# EAGLE design Program Cable (EAGLE 9.7.0)
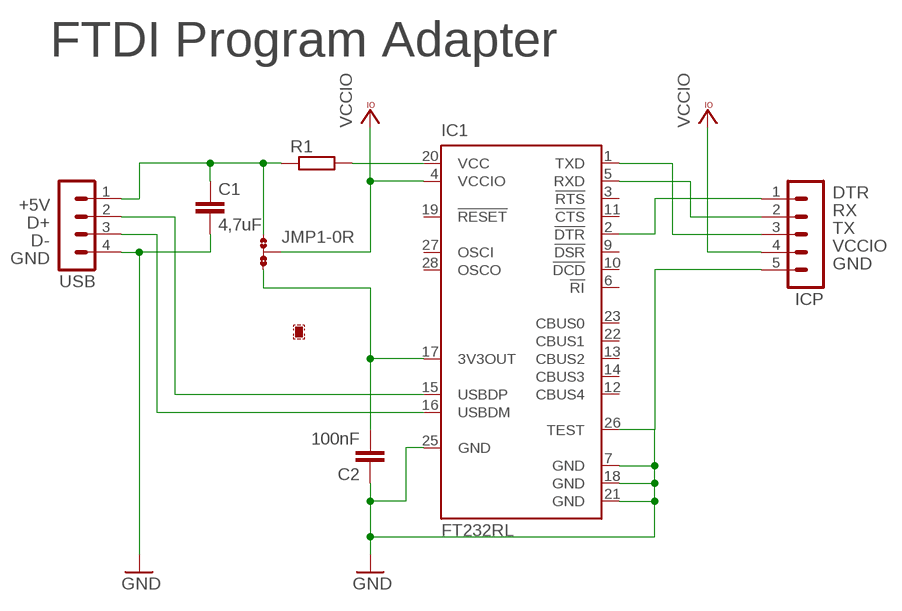
[diagram p0: schematic, sheet 1]

## Parts
C1  4,7uF  C-EUC1206  [C1206]
C2  100nF  C-EUC0402  [C0402]
IC1  FT232RL  [SSOP28]
ICP  MA05-1  [MA05-1]
JMP1  0R-JUMPA  [A0R-JMP]
R1  R-EU_R0805  [R0805]
USB  MA04-1  [MA04-1]

## Nets
3V3: C2.2 IC1.17(3V3OUT) JMP1.3
+5V: C1.1 JMP1.1 R1.1 USB.1
D+: IC1.15(USBDP) USB.2
D-: IC1.16(USBDM) USB.3
DTR: IC1.2(!DTR) ICP.1
GND: C1.2 C2.1 IC1.7(GND) IC1.18(GND) IC1.21(GND) IC1.25(GND) IC1.26(TEST) ICP.5 USB.4
N$1: IC1.20(VCC) R1.2
RX: IC1.5(RXD) ICP.2
TX: IC1.1(TXD) ICP.3
VCCIO: IC1.4(VCCIO) ICP.4 JMP1.2
Unconnected: IC1.3(!RTS) IC1.6(!RI) IC1.9(!DSR) IC1.10(!DCD) IC1.11(!CTS) IC1.12(CBUS4) IC1.13(CBUS2) IC1.14(CBUS3) IC1.19(!RESET) IC1.22(CBUS1) IC1.23(CBUS0) IC1.27(OSCI) IC1.28(OSCO)

## Notes on the sheet
- FTDI Program Adapter

## Library data of the parts
C1 C2 = rcl:C-EU: CAPACITOR, European symbol; SPICEPREFIX: C
IC1 = ftdichip:FT232R: Source: http://www.ftdichip.com/Documents/DataSheets/DS_FT232R_v104.pdf; MPN: FT232RL; OC_FARNELL: 1146032; OC_NEWARK: 91K9918
ICP = con-lstb:MA05-1: PIN HEADER; OC_FARNELL: unknown; OC_NEWARK: unknown
JMP1 = jump-0r-smd:0R-JUMP: SMD 0R 0805 Jumper
R1 = rcl:R-EU_: RESISTOR, European symbol; SPICEPREFIX: R
USB = con-lstb:MA04-1: PIN HEADER; OC_FARNELL: unknown; OC_NEWARK: unknown

## Board
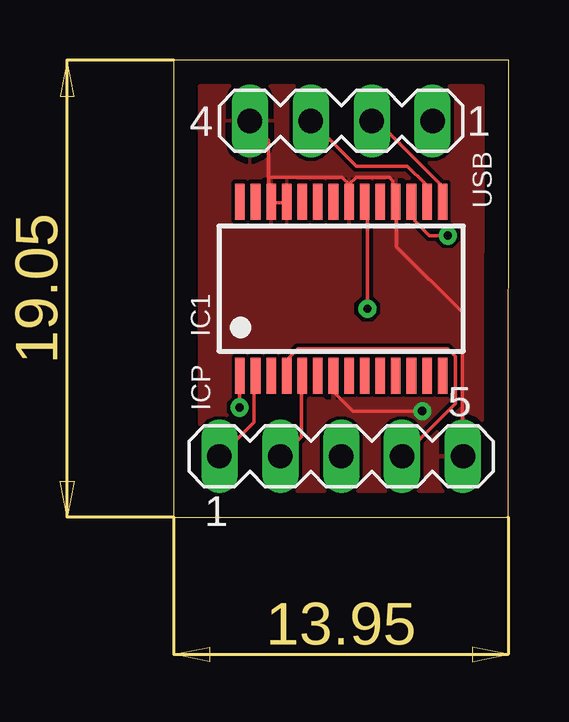
[diagram p1: board, top side]
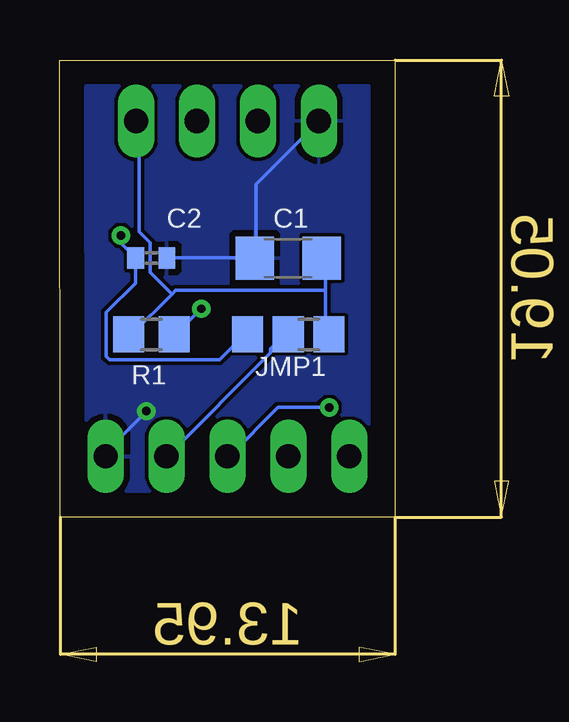
[diagram p2: board, bottom side, seen from below]

Size 13.97 x 19.05 mm. Coordinates in mm from the lower left corner, seen from the top.
Outline: 0,0 13.95,0 13.97,19.05 0,19.05 0,0
Copper layers (1*16): Top / Bottom
Stack-up Default Layer Stack: Top User Defined 0.035mm / Dielectric-1 User Defined 1.5mm / Bottom User Defined 0.035mm
Design rules "default": minimum track width 6mil, minimum drill 0.35mm, track to track 6mil, track to pad 6mil, pad to pad 6mil, via to via 6mil, smd to smd 6mil, copper to edge 40mil, drill to drill 6mil, minimum pad ring 10mil, minimum via ring 8mil, stop-mask expansion 4mil, vias tented up to drill 0mil, thermal gap 10mil

### Footprints (pad centres in the part's own frame; a part is rotated, then mirrored left to right if it is on the bottom)
C1206 = smd 1.6 x 1.8: 1 -1.4,0; 2 1.4,0
C0402 = smd 0.7 x 0.9: 1 -0.65,0; 2 0.65,0
SSOP28 = smd 0.4 x 1.5: 1 -4.225,-3.625; 2 -3.575,-3.625; 3 -2.925,-3.625; 4 -2.275,-3.625; 5 -1.625,-3.625; 6 -0.975,-3.625; 7 -0.325,-3.625; 8 0.325,-3.625; 9 0.975,-3.625; 10 1.625,-3.625; 11 2.275,-3.625; 12 2.925,-3.625; 13 3.575,-3.625; 14 4.225,-3.625; 15 4.225,3.625; 16 3.575,3.625; 17 2.925,3.625; 18 2.275,3.625; 19 1.625,3.625; 20 0.975,3.625; 21 0.325,3.625; 22 -0.325,3.625; 23 -0.975,3.625; 24 -1.625,3.625; 25 -2.275,3.625; 26 -2.925,3.625; 27 -3.575,3.625; 28 -4.225,3.625
MA05-1 = drill 1.016 long: 1 -5.08,0; 2 -2.54,0; 3 0,0; 4 2.54,0; 5 5.08,0
A0R-JMP = smd 1.5 x 1.3: 1 0,1.7; 2 0,0; 3 0,-1.7
R0805 = smd 1.3 x 1.5: 1 -0.95,0; 2 0.95,0
MA04-1 = drill 1.016 long: 1 -3.81,0; 2 -1.27,0; 3 1.27,0; 4 3.81,0

### Placement (x,y rotation side)
C1  4.45,10.79 180 bottom
C2  10.16,10.79 180 bottom
IC1  6.99,9.53 0 top
ICP  6.99,2.54 0 top
JMP1  4.45,7.62 270 bottom
R1  10.16,7.62 0 bottom
USB  6.99,16.51 180 top

### Tracks (layer width: path | path; a pad name or v marks a point on that pad's centre or on a via)
3V3  (via drill 0.35)
  Top 0.152: v11.43,11.73 10.67,11.73 10.06,12.34 10.06,13.11 IC1.17
  Bottom 0.152: JMP1.3 6.25,7.62 7.32,6.55 11.89,6.55 12.04,6.71 12.04,8.53 10.82,9.75 10.82,10.67 C2.2 10.82,10.82 11.43,11.43 v11.43,11.73
+5V
  Bottom 0.152: 2.9,9.45 2.9,10.67 C1.1 | 2.9,9.45 2.9,7.62 JMP1.1 | 9.3,9.3 9.14,9.45 2.9,9.45 | 9.3,9.3 10.97,7.62 R1.1 | 9.3,9.3 10.21,10.21 10.21,11.43 10.67,11.89 10.67,16.46 USB.1
D+
  Top 0.152: IC1.15 11.12,13.26 11.12,13.87 8.38,16.61 USB.2
D-
  Top 0.152: IC1.16 10.52,13.26 10.52,13.87 9.75,14.63 7.62,14.63 5.79,16.46 USB.3
DTR
  Top 0.152: IC1.2 3.35,5.79 3.35,3.96 1.98,2.59 ICP.1
GND  (via drill 0.35)
  Top 0.152: v10.36,4.42 7.47,4.42 6.71,5.18 6.71,5.79 IC1.7 | 7.32,13.87 7.32,13.26 IC1.21 7.32,13.87 | 7.32,13.87 7.62,14.17 8.99,14.17 9.14,14.02 9.14,13.26 IC1.18 9.3,13.11 9.3,11.28 12.04,8.53 12.04,2.59 ICP.5 | IC1.25 4.57,13.11 4.12,13.11 IC1.26 3.96,13.26 3.96,14.17 | 3.96,14.17 3.96,15.7 3.2,16.46 USB.4 | 7.32,13.87 7.01,14.17 3.96,14.17
  Bottom 0.152: v10.36,4.42 12.19,2.59 ICP.5 | C2.1 9.45,10.82 5.94,10.82 C1.2 5.79,10.82 5.79,13.87 3.2,16.46 USB.4
  pour Bottom: 14.05,19.13 -0.08,19.13 -0.08,-0.08 14.05,-0.08
  pour Top: 14.05,19.13 -0.08,19.13 -0.08,-0.08 14.05,-0.08
N$1  (via drill 0.35)
  Top 0.152: v8.08,8.69 8.08,13.11 IC1.20
  Bottom 0.152: v8.08,8.69 9.14,7.62 R1.2
RX
  Top 0.152: IC1.5 5.33,5.79 5.33,3.35 4.57,2.59 ICP.2
TX  (via drill 0.35)
  Top 0.152: v2.74,4.57 2.74,5.79 IC1.1
  Bottom 0.152: v2.74,4.57 4.88,4.57 6.86,2.59 ICP.3
VCCIO
  Top 0.152: IC1.4 4.72,5.94 4.72,6.55 5.18,7.01 11.43,7.01 11.73,6.71 11.73,4.72 9.6,2.59 ICP.4
  Bottom 0.152: JMP1.2 4.57,7.62 5.18,7.01 5.18,6.86 9.45,2.59 ICP.4